# EAGLE schematic mult (EAGLE 7.1.0)
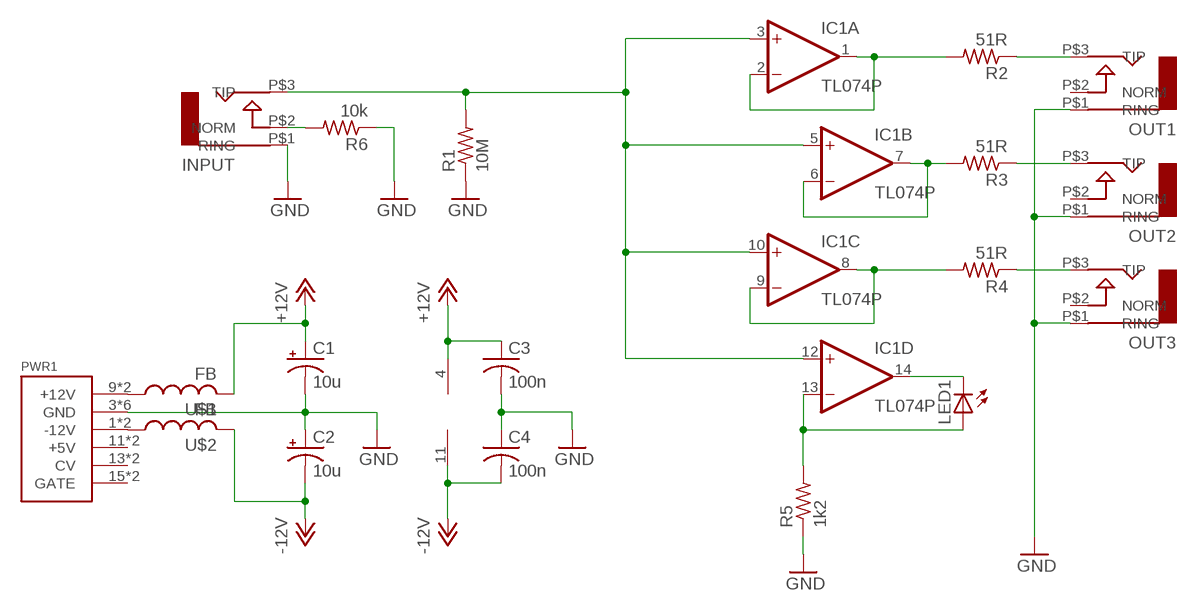
[diagram p0: schematic, sheet 1]

## Parts
C1  10u  CPOL-USB45181A  [B45181A]
C2  10u  CPOL-USB45181A  [B45181A]
C3  100n  C-US050-024X044  [C050-024X044]
C4  100n  C-US050-024X044  [C050-024X044]
IC1  TL074P  [DIL14]
INPUT  AUDIO-JACK  [ERTHENVAR-JACK-90DEG]
LED1  LED5MM  [LED5MM]
OUT1  AUDIO-JACK  [ERTHENVAR-JACK-90DEG]
OUT2  AUDIO-JACK  [ERTHENVAR-JACK-90DEG]
OUT3  AUDIO-JACK  [ERTHENVAR-JACK-90DEG]
PWR1  POWER  [POWER_16]
R1  10M  R-US_0207/10  [0207/10]
R2  51R  R-US_0207/10  [0207/10]
R3  51R  R-US_0207/10  [0207/10]
R4  51R  R-US_0207/10  [0207/10]
R5  1k2  R-US_0207/10  [0207/10]
R6  10k  R-US_0207/10  [0207/10]
U$1  FB  [FB]
U$2  FB  [FB]

## Nets
+12V: C1.+ C3.1 IC1.4(P:V+) U$1.P$2
-12V: C2.- C4.2 IC1.11(P:V-) U$2.P$2
GND: C1.- C2.+ C3.2 C4.1 INPUT.P$1(RING) OUT1.P$1(RING) OUT2.P$1(RING) OUT3.P$1(RING) PWR1.3(GND) PWR1.4(GND) PWR1.5(GND) PWR1.6(GND) PWR1.7(GND) PWR1.8(GND) R1.1 R5.1 R6.1
N$1: PWR1.9(+12V) PWR1.10(+12V) U$1.P$1
N$2: PWR1.1(-12V) PWR1.2(-12V) U$2.P$1
N$3: OUT1.P$3(TIP) R2.1
N$4: OUT2.P$3(TIP) R3.1
N$5: OUT3.P$3(TIP) R4.1
N$6: INPUT.P$2(NORM) R6.2
N$7: IC1.1(A:OUT) IC1.2(A:-IN) R2.2
N$8: IC1.6(B:-IN) IC1.7(B:OUT) R3.2
N$9: IC1.8(C:OUT) IC1.9(C:-IN) R4.2
N$10: IC1.14(D:OUT) LED1.K(C)
N$11: IC1.13(D:-IN) LED1.A R5.2
N$12: IC1.3(A:+IN) IC1.5(B:+IN) IC1.10(C:+IN) IC1.12(D:+IN) INPUT.P$3(TIP) R1.2
Unconnected: OUT1.P$2(NORM) OUT2.P$2(NORM) OUT3.P$2(NORM) PWR1.11(+5V) PWR1.12(+5V) PWR1.13(CV) PWR1.14(CV) PWR1.15(GATE) PWR1.16(GATE)

## Library data of the parts
C1 C2 = rcl:CPOL-US: POLARIZED CAPACITOR, American symbol
C3 C4 = rcl:C-US: CAPACITOR, American symbol
IC1 = linear:TL074: OP AMP
INPUT OUT1-OUT3 = erthenvar:AUDIO-JACK: Switching Mono 3.5mm Audio Jack from Erthenvar.
LED1 = led:LED: LED OSRAM: - CHIPLED LG R971, LG N971, LY N971, LG Q971, LY Q971, LO R971, LY R971 LH N974, LH R974 LS Q976, LO Q976, LY Q976 LO Q996 - Hyper CHIPLED LW Q18S LB Q993, LB Q99A, LB R99A - SideLED LS A670, LO A670, LY A670, LG A670, LP A670 LB A673, LV A673, LT A673, LW A673 LH A674 LY A675 LS A676, LA A676, LO A676, LY A676, LW A676 LS A679, LY A679, LG A679 - Hyper Micro SIDELED® LS Y876, LA Y876, LO Y876, LY Y876 LT Y87S - SmartLED LW L88C, LW L88S LB L89C, LB L89S, LG L890 LS L89K, LO L89K, LY L89K LS L896, LA L896, LO L896, LY L896 - TOPLED LS T670, LO T670, LY T670, LG T670, LP T670 LSG T670, LSP T670, LSY T670, LOP T670, LYG T670 LG T671, LOG T671, LSG T671 LB T673, LV T673, LT T673, LW T673 LH T674 LS T676, LA T676, LO T676, LY T676, LB T676, LH T676, LSB T676, LW T676 LB T67C, LV T67C, LT T67C, LS T67K, LO T67K, LY T67K, LW E67C LS E67B, LA E67B, LO E67B, LY E67B, LB E67C, LV E67C, LT E67C LW T67C LS T679, LY T679, LG T679 LS T770, LO T770, LY T770, LG T770, LP T770 LB T773, LV T773, LT T773, LW T773 LH T774 LS E675, LA E675, LY E675, LS T675 LS T776, LA T776, LO T776, LY T776, LB T776 LHGB T686 LT T68C, LB T68C - Hyper Mini TOPLED® LB M676 - Mini TOPLED Santana® LG M470 LS M47K, LO M47K, LY M47K Source: http://www.osram.convergy.de LUXEON: - LUMILED® LXK2-PW12-R00, LXK2-PW12-S00, LXK2-PW14-U00, LXK2-PW14-V00 LXK2-PM12-R00, LXK2-PM12-S00, LXK2-PM14-U00 LXK2-PE12-Q00, LXK2-PE12-R00, LXK2-PE12-S00, LXK2-PE14-T00, LXK2-PE14-U00 LXK2-PB12-K00, LXK2-PB12-L00, LXK2-PB12-M00, LXK2-PB14-N00, LXK2-PB14-P00, LXK2-PB14-Q00 LXK2-PR12-L00, LXK2-PR12-M00, LXK2-PR14-Q00, LXK2-PR14-R00 LXK2-PD12-Q00, LXK2-PD12-R00, LXK2-PD12-S00 LXK2-PH12-R00, LXK2-PH12-S00 LXK2-PL12-P00, LXK2-PL12-Q00, LXK2-PL12-R00 Source: www.luxeon.com KINGBRIGHT: KA-3528ASYC Source: www.kingbright.com
PWR1 = eurorack:POWER
R1-R6 = rcl:R-US_: RESISTOR, American symbol
U$1 U$2 = adafruit:FB: Ferrite bead Digikey #P9821BK-ND